# EAGLE design tricorder-photodiode-breakout-mk-1.2 (EAGLE 7.5.0)
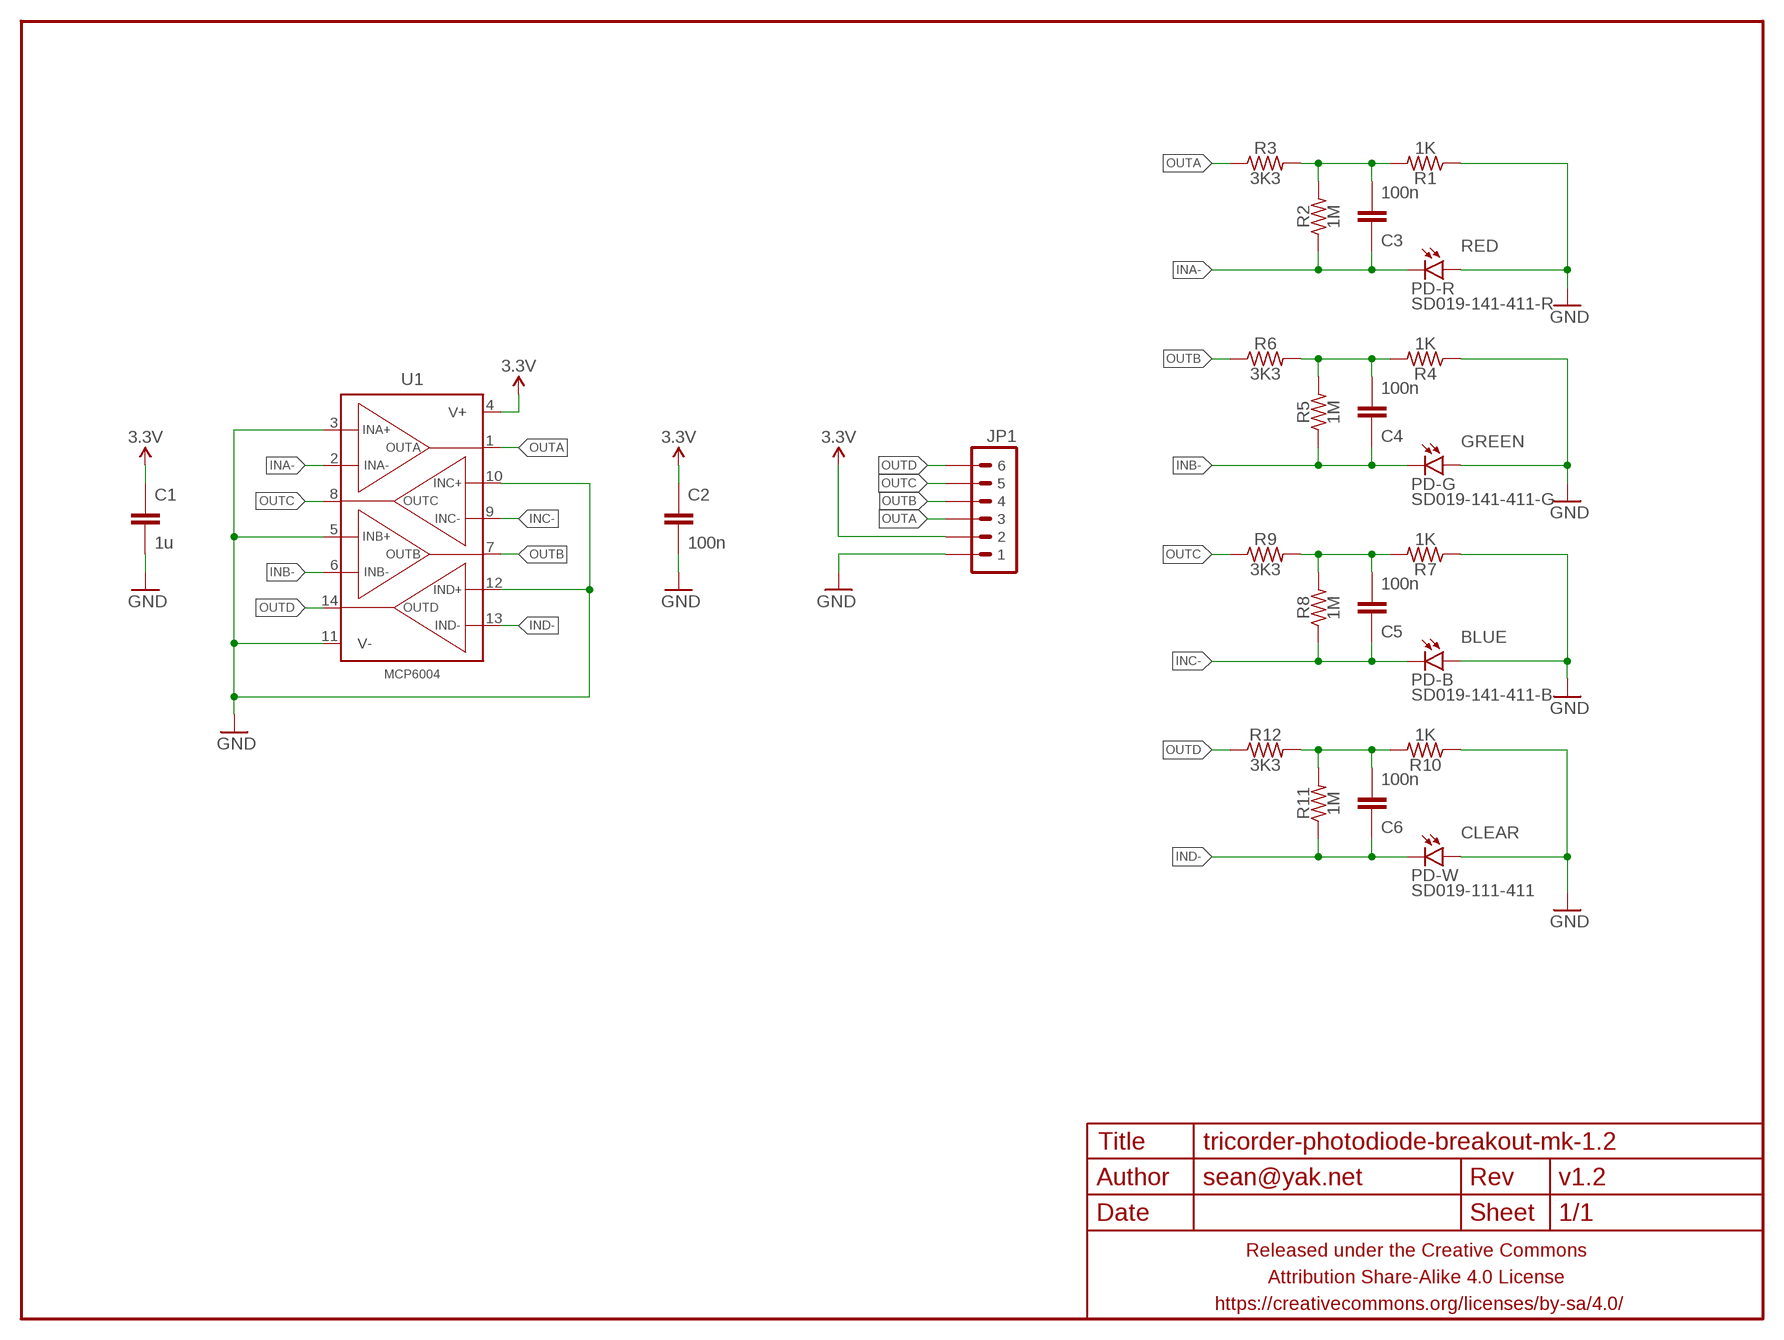
[diagram p0: schematic, sheet 1]

## Parts
C1  1u  CAPACITOR-CERAMICC0603  [C0603]
C2  100n  CAPACITOR-CERAMICC0603  [C0603]
C3  100n  CAPACITOR-CERAMICC0603  [C0603]
C4  100n  CAPACITOR-CERAMICC0603  [C0603]
C5  100n  CAPACITOR-CERAMICC0603  [C0603]
C6  100n  CAPACITOR-CERAMICC0603  [C0603]
FRAME1  FRAME-LETTERNO_PACKAGE  [DUMMY]
JP1  M06PTH_CENTERED  [1X06_CENTERED]
PD-B  SD019-141-411-B  PHOTODIODESMD-0805  [LED-0805]
PD-G  SD019-141-411-G  PHOTODIODESMD-0805  [LED-0805]
PD-R  SD019-141-411-R  PHOTODIODESMD-0805  [LED-0805]
PD-W  SD019-111-411  PHOTODIODESMD-0805  [LED-0805]
R1  1K  RESISTORR0603  [R0603]
R2  1M  RESISTORR0603  [R0603]
R3  3K3  RESISTORR0603  [R0603]
R4  1K  RESISTORR0603  [R0603]
R5  1M  RESISTORR0603  [R0603]
R6  3K3  RESISTORR0603  [R0603]
R7  1K  RESISTORR0603  [R0603]
R8  1M  RESISTORR0603  [R0603]
R9  3K3  RESISTORR0603  [R0603]
R10  1K  RESISTORR0603  [R0603]
R11  1M  RESISTORR0603  [R0603]
R12  3K3  RESISTORR0603  [R0603]
U1  MCP6004  MCP6004SOIC14  [SO14]

## Nets
3.3V: C1.1 C2.1 JP1.2 U1.4(V+)
GND: C1.2 C2.2 JP1.1 PD-B.A PD-G.A PD-R.A PD-W.A R1.1 R4.1 R7.1 R10.1 U1.3(INA+) U1.5(INB+) U1.10(INC+) U1.11(V-) U1.12(IND+)
INA-: C3.1 PD-R.C R2.1 U1.2(INA-)
INB-: C4.1 PD-G.C R5.1 U1.6(INB-)
INC-: C5.1 PD-B.C R8.1 U1.9(INC-)
IND-: C6.1 PD-W.C R11.1 U1.13(IND-)
N$5: C3.2 R1.2 R2.2 R3.2
N$6: C4.2 R4.2 R5.2 R6.2
N$7: C5.2 R7.2 R8.2 R9.2
N$8: C6.2 R10.2 R11.2 R12.2
OUTA: JP1.3 R3.1 U1.1(OUTA)
OUTB: JP1.4 R6.1 U1.7(OUTB)
OUTC: JP1.5 R9.1 U1.8(OUTC)
OUTD: JP1.6 R12.1 U1.14(OUTD)

## Notes on the sheet
- RED
- GREEN
- BLUE
- CLEAR

## Library data of the parts
C1-C6 = a_parts:CAPACITOR-CERAMIC: CAPACITOR, European symbol
FRAME1 = a_parts:FRAME-LETTER: Schematic Frame Standard 8.5x11 US Letter frame; DESIGNER: sean@yak.net; VERSION: v1.2
JP1 = a_parts:M06: Header 6 Standard 6-pin 0.1" header. Use with straight break away headers (SKU : PRT-00116), right angle break away headers (PRT-00553), swiss pins (PRT-00743), machine pins (PRT-00117), and female headers (PRT-00115). Molex polarized connector foot print use with SKU : PRT-08094 with associated crimp pins and housings. NOTES ON THE VARIANTS LOCK and LOCK_LONGPADS... This footprint was designed to help hold the alignment of a through-hole component (i.e. 6-pin header) while soldering it into place. You may notice that each hole has been shifted either up or down by 0.005 of an inch from it's more standard position (which is a perfectly straight line). This slight alteration caused the pins (the squares in the middle) to touch the edges of the holes. Because they are alternating, it causes a "brace" to hold the component in place. 0.005 has proven to be the perfect amount of "off-center" position when using our standard breakaway headers. Although looks a little odd when you look at the bare footprint, once you have a header in there, the alteration is very hard to notice. Also,if you push a header all the way into place, it is covered up entirely on the bottom side. This idea of altering the position of holes to aid alignment will be further integrated into the Sparkfun Library for other footprints. It can help hold any component with 3 or more connection pins.
PD-B PD-G PD-R PD-W = a_parts:PHOTODIODE
R1-R12 = a_parts:RESISTOR: RESISTOR, American symbol
U1 = a_parts:MCP6004

## Board
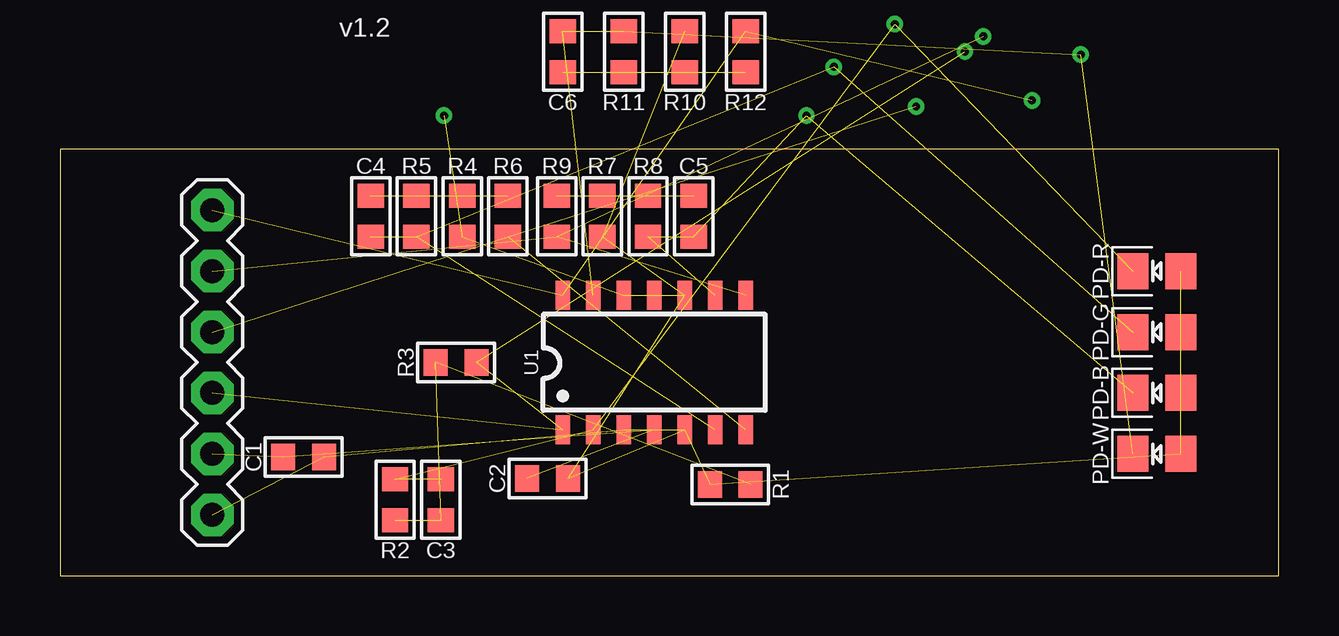
[diagram p1: board, top side]
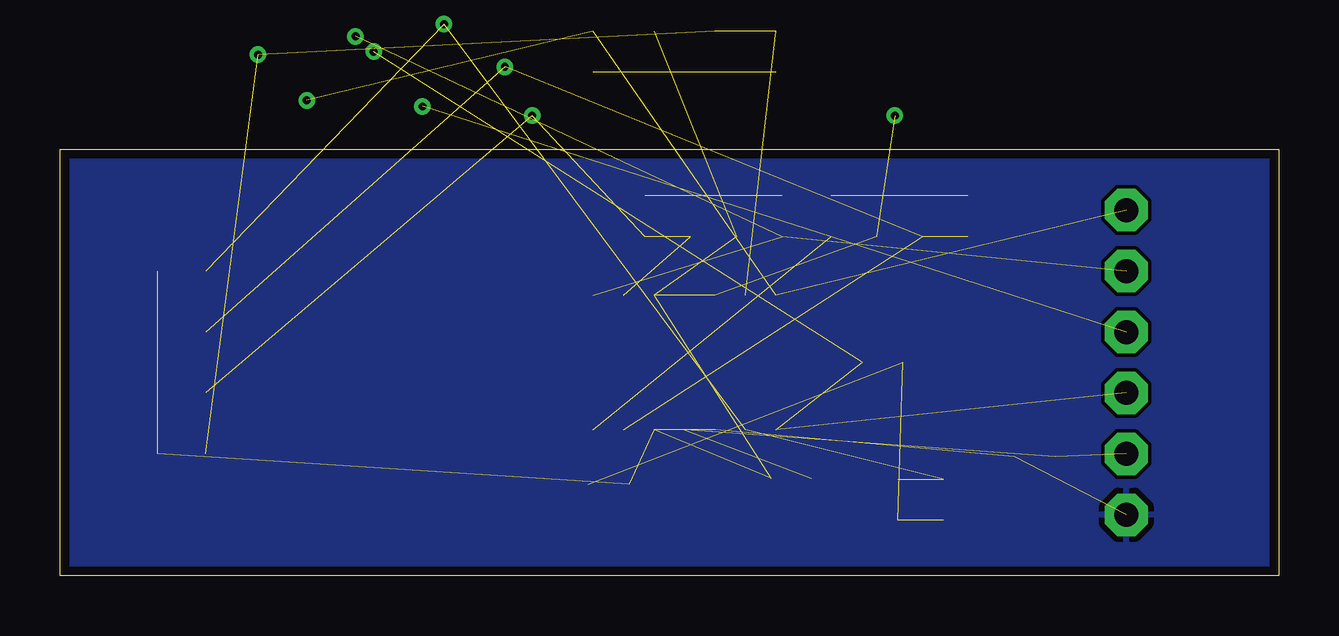
[diagram p2: board, bottom side, seen from below]

Size 50.8 x 17.78 mm. Coordinates in mm from the lower left corner, seen from the top.
Outline: 0,0 50.8,0 50.8,17.78 0,17.78 0,0
Copper layers (1*16): Top 0.0356mm / dielectric 1.5011mm / Bottom 0.0356mm
Design rules "LaenPCBOrder2": minimum track width 6mil, minimum drill 13mil, track to track 6mil, track to pad 6mil, pad to pad 6mil, via to via 6mil, smd to smd 6mil, copper to edge 15mil, drill to drill 6mil, minimum pad ring 7mil, minimum via ring 7mil, stop-mask expansion 3mil, vias tented up to drill 20mil, thermal gap 10mil

### Footprints (pad centres in the part's own frame; a part is rotated, then mirrored left to right if it is on the bottom)
C0603 = smd 1 x 1.1: 1 -0.85,0; 2 0.85,0
1X06_CENTERED = drill 1 pad 1.778 octagon: 1 -6.35,0; 2 -3.81,0; 3 -1.27,0; 4 1.27,0; 5 3.81,0; 6 6.35,0
LED-0805 = smd 1.5 x 1.3: A 0,-1; C 0,1
R0603 = smd 1 x 1.1: 1 -0.85,0; 2 0.85,0
SO14 = smd 0.6 x 1.2: 1 -3.81,-2.8; 2 -2.54,-2.8; 3 -1.27,-2.8; 4 0,-2.8; 5 1.27,-2.8; 6 2.54,-2.8; 7 3.81,-2.8; 8 3.81,2.8; 9 2.54,2.8; 10 1.27,2.8; 11 0,2.8; 12 -1.27,2.8; 13 -2.54,2.8; 14 -3.81,2.8

### Placement (x,y rotation side)
C1  10.16,4.95 0 top
C2  20.32,4.06 0 top
C3  15.88,3.17 270 top
C4  12.95,14.99 90 top
C5  26.42,14.99 90 top
C6  20.95,21.84 270 top  (outside the outline)
FRAME1  0,0 0 top
JP1  6.35,8.89 90 top
PD-B  45.72,7.62 90 top
PD-G  45.72,10.16 90 top
PD-R  45.72,12.7 90 top
PD-W  45.72,5.08 90 top
R1  27.94,3.81 0 top
R2  13.97,3.17 270 top
R3  16.51,8.89 180 top
R4  16.76,14.99 90 top
R5  14.86,14.99 90 top
R6  18.67,14.99 90 top
R7  22.61,14.99 90 top
R8  24.51,14.99 90 top
R9  20.7,14.99 90 top
R10  26.04,21.84 270 top  (outside the outline)
R11  23.5,21.84 270 top  (outside the outline)
R12  28.57,21.84 270 top  (outside the outline)
U1  24.77,8.89 0 top

### Tracks (layer width: path | path; a pad name or v marks a point on that pad's centre or on a via)
3.3V  (3 unrouted)
GND  (via drill 0.33)  (16 unrouted)
  other vias: 16,19.18
  pour Bottom: 0,0 50.8,0 50.8,17.78 0,17.78
INA-  (via drill 0.33)  (4 unrouted)
  other vias: 34.8,22.99
INB-  (via drill 0.33)  (4 unrouted)
  other vias: 32.26,21.21
INC-  (via drill 0.33)  (4 unrouted)
  other vias: 31.11,19.18
IND-  (via drill 0.33)  (4 unrouted)
  other vias: 42.55,21.72
N$5  (3 unrouted)
N$6  (3 unrouted)
N$7  (3 unrouted)
N$8  (3 unrouted)
OUTA  (via drill 0.33)  (3 unrouted)
  other vias: 37.72,21.84
OUTB  (via drill 0.33)  (3 unrouted)
  other vias: 35.69,19.56
OUTC  (via drill 0.33)  (3 unrouted)
  other vias: 38.48,22.48
OUTD  (via drill 0.33)  (3 unrouted)
  other vias: 40.51,19.81